# EAGLE schematic Accessory - ADC (EAGLE 5.06)
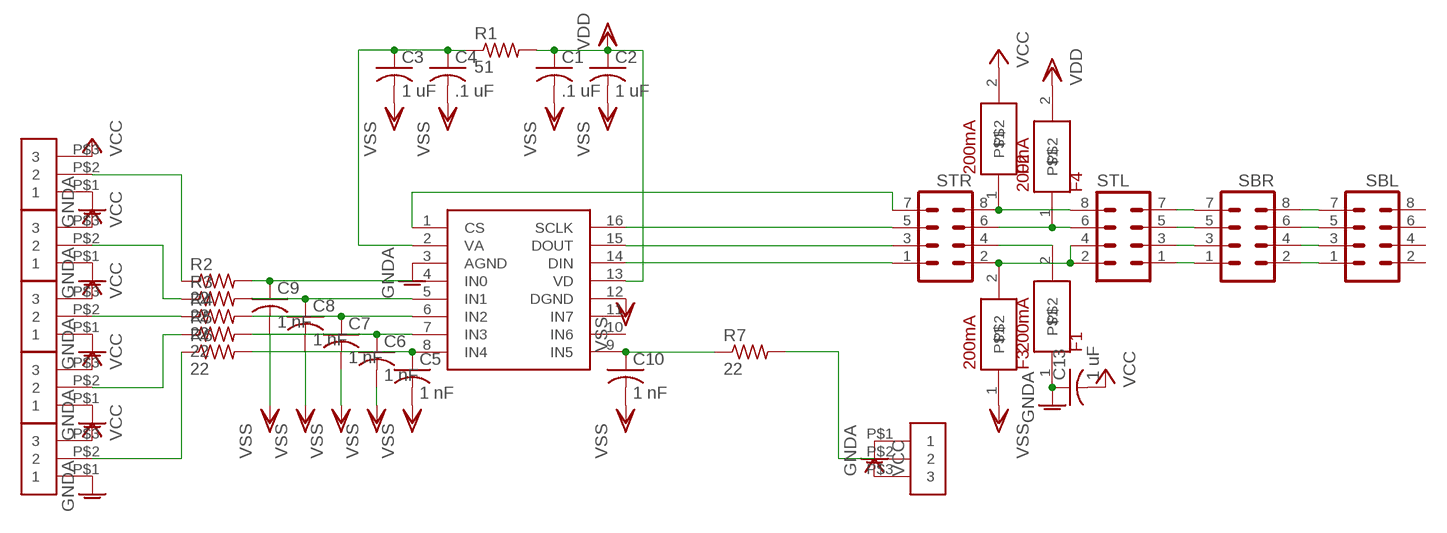
[diagram p0: schematic, sheet 1]

## Parts
C1  .1 uF  C-USC0603  [C0603]
C2  1 uF  C-USC0603  [C0603]
C3  1 uF  C-USC0603  [C0603]
C4  .1 uF  C-USC0603  [C0603]
C5  1 nF  C-USC0201  [C0201]
C6  1 nF  C-USC0201  [C0201]
C7  1 nF  C-USC0201  [C0201]
C8  1 nF  C-USC0201  [C0201]
C9  1 nF  C-USC0201  [C0201]
C10  1 nF  C-USC0201  [C0201]
C13  1 uF  C-USC0603  [C0603]
F1  200mA  FUSE  [R0603]
F2  200mA  FUSE  [R0603]
F3  200mA  FUSE  [R0603]
F4  200mA  FUSE  [R0603]
R1  51  R-US_R0603  [R0603]
R2  22  R-US_R0201  [R0201]
R3  22  R-US_R0201  [R0201]
R4  22  R-US_R0201  [R0201]
R5  22  R-US_R0201  [R0201]
R6  22  R-US_R0201  [R0201]
R7  22  R-US_R0201  [R0201]
SBL  MA04-2  [MA04-2]
SBR  MA04-2  [MA04-2]
STL  MA04-2  [MA04-2]
STR  MA04-2  [MA04-2]
U$1  ADC128S102TSSOP16  [TSSOP16]
U$4  292227-3  [292227-3]
U$5  292227-3  [292227-3]
U$6  292227-3  [292227-3]
U$7  292227-3  [292227-3]
U$8  292227-3  [292227-3]
U$9  292227-3  [292227-3]

## Nets
GNDA: C13.1 F1.1 U$1.3(AGND) U$4.P$1 U$5.P$1 U$6.P$1 U$7.P$1 U$8.P$1 U$9.P$1
N$1: C5.1 R6.2 U$1.8(IN4)
N$2: C10.1 R7.1 U$1.9(IN5)
N$3: C6.1 R5.2 U$1.7(IN3)
N$4: C7.1 R4.2 U$1.6(IN2)
N$5: C8.1 R3.2 U$1.5(IN1)
N$6: C9.1 R2.2 U$1.4(IN0)
N$10: SBR.7 STL.7
N$11: SBR.5 STL.5
N$12: SBR.3 STL.3
N$13: SBR.1 STL.1
N$14: SBL.1 SBR.2
N$15: SBL.3 SBR.4
N$16: SBL.5 SBR.6
N$17: SBL.7 SBR.8
N$18: STR.7 U$1.1(CS)
N$19: STR.5 U$1.16(SCLK)
N$20: F4.1 STL.6 STR.6
N$21: F3.2 STL.2 STL.4 STR.2
N$22: STR.3 U$1.15(DOUT)
N$23: STR.1 U$1.14(DIN)
N$24: F1.2 STR.4
N$25: R2.1 U$9.P$2
N$26: R3.1 U$5.P$2
N$27: R4.1 U$6.P$2
N$28: R5.1 U$7.P$2
N$29: R6.1 U$8.P$2
N$32: R7.2 U$4.P$2
N$33: F2.1 STL.8 STR.8
N$34: C3.1 C4.1 R1.1 U$1.2(VA)
VCC: C13.2 F2.2 U$4.P$3 U$5.P$3 U$6.P$3 U$7.P$3 U$8.P$3 U$9.P$3
VDD: C1.1 C2.1 F4.2 R1.2 U$1.13(VD)
VSS: C1.2 C2.2 C3.2 C4.2 C5.2 C6.2 C7.2 C8.2 C9.2 C10.2 F3.1 U$1.12(DGND)
Unconnected: SBL.2 SBL.4 SBL.6 SBL.8 U$1.10(IN6) U$1.11(IN7)

## Library data of the parts
C1-C10 C13 = rcl:C-US: CAPACITOR, American symbol
F1-F4 = rcl:FUSE
R1-R7 = rcl:R-US_: RESISTOR, American symbol
SBL SBR STL STR = con-lstb:MA04-2: PIN HEADER
U$1 = ref-packages:ADC128S102
U$4-U$9 = con-tyco:292227-3